# EAGLE design Impedance (EAGLE 9.6.2)
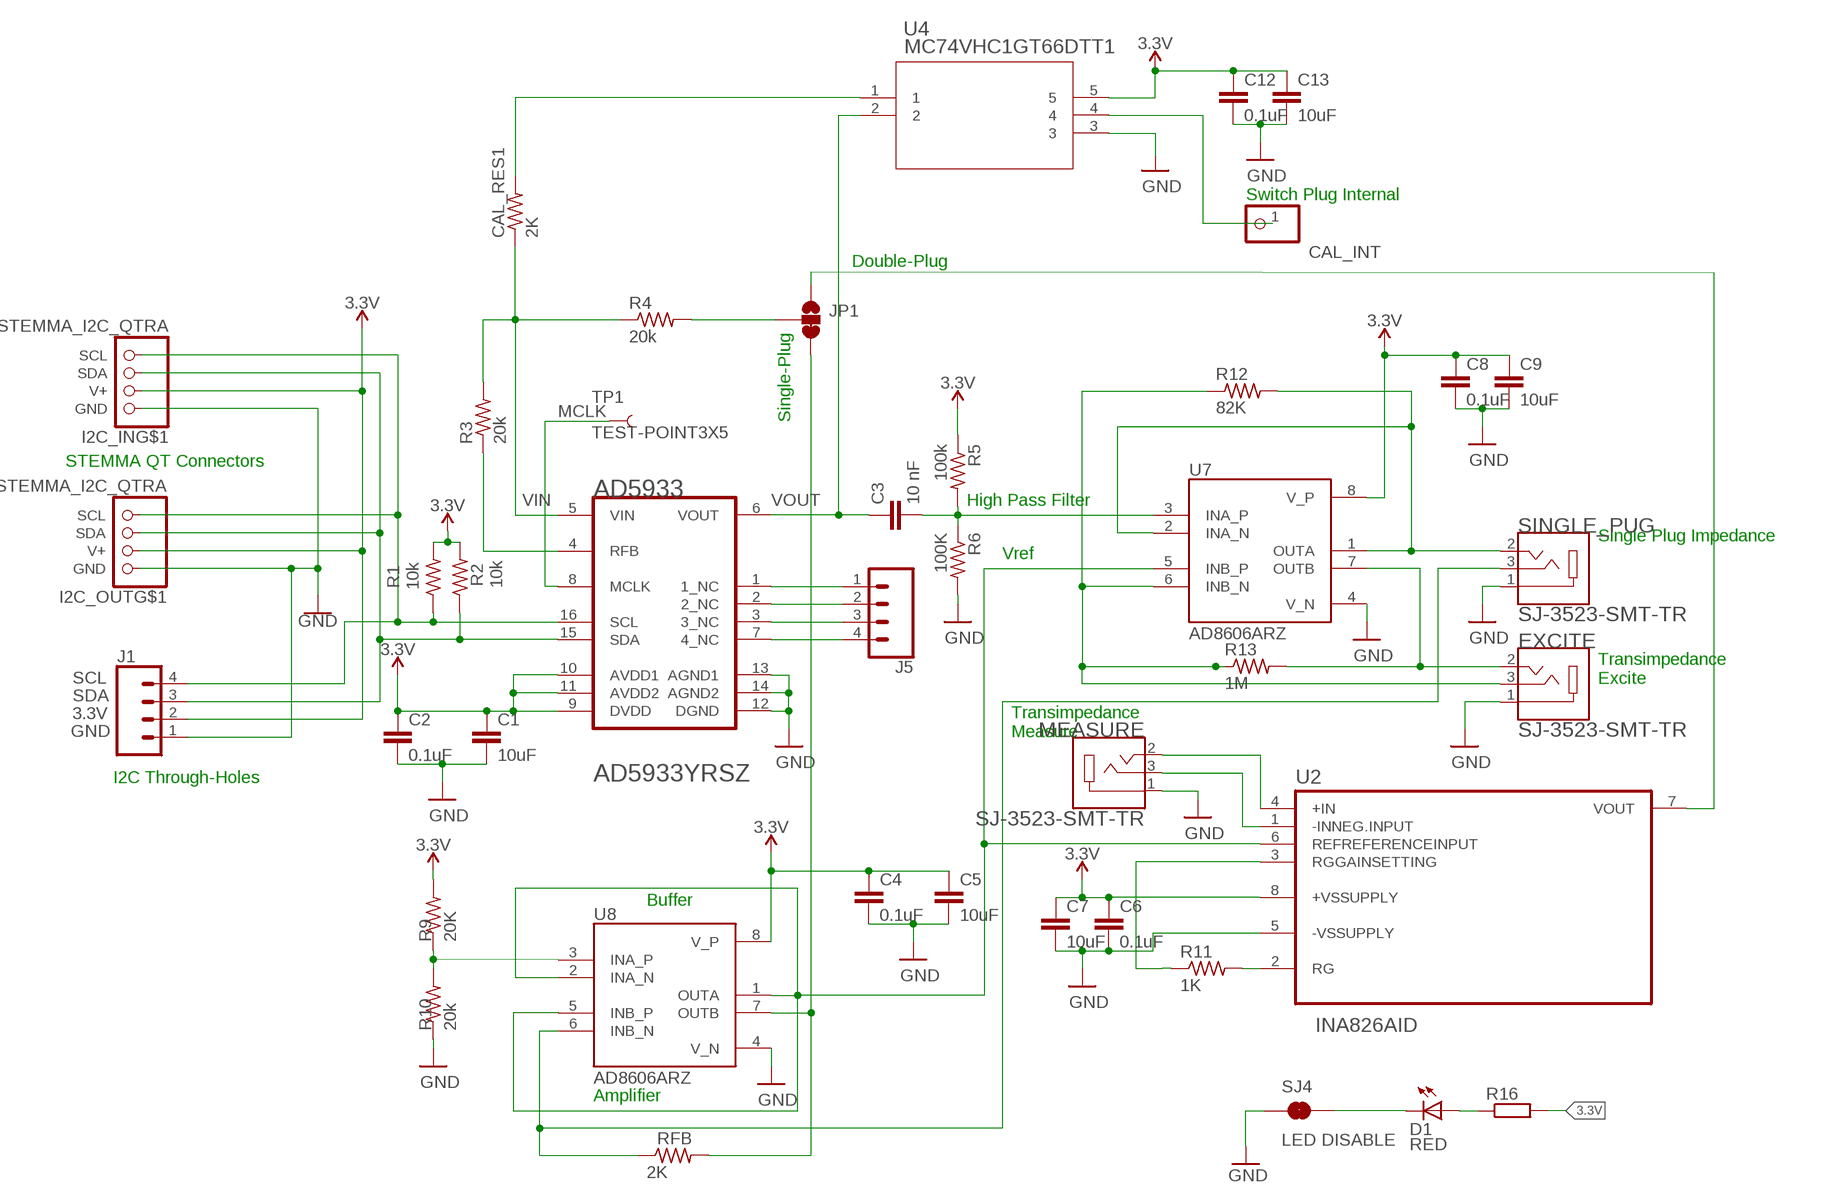
[diagram p0: schematic, sheet 1]

## Parts
AD5933  ANALOG_DEVICES_AD5933YRSZANALOG_DEVICES_AD5933YRSZ_0_0  [ANALOG_DEVICES_AD5933YRSZ_0]
C1  10uF  C-EUC0603  [C0603]
C2  0.1uF  C-EUC0603  [C0603]
C3  10 nF  C-EUC0603  [C0603]
C4  0.1uF  C-EUC0603  [C0603]
C5  10uF  C-EUC0603  [C0603]
C6  0.1uF  C-EUC0603  [C0603]
C7  10uF  C-EUC0603  [C0603]
C8  0.1uF  C-EUC0603  [C0603]
C9  10uF  C-EUC0603  [C0603]
C12  0.1uF  C-EUC0603  [C0603]
C13  10uF  C-EUC0603  [C0603]
CAL_INT  PINHD-1X1  [1X01]
CAL_RES1  2K  R-US_R0603  [R0603]
D1  RED  LED-RED0603  [LED-0603]
EXCITE  SJ-3523-SMT-TR  [CUI_SJ-3523-SMT-TR]
I2C_IN  STEMMA_I2C_QTRA  [JST_SH4_RA]
I2C_OUT  STEMMA_I2C_QTRA  [JST_SH4_RA]
J1  CONN_04  [1X04]
J5  CONN_04  [1X04]
JP1  JUMPER-SMT_3_1-NC_TRACE_NO-SILK  [SMT-JUMPER_3_1-NC_TRACE_NO-SILK]
MEASURE  SJ-3523-SMT-TR  [CUI_SJ-3523-SMT-TR]
R1  10k  R-US_R0603  [R0603]
R2  10k  R-US_R0603  [R0603]
R3  20k  R-US_R0603  [R0603]
R4  20k  R-US_R0603  [R0603]
R5  100k  R-US_R0603  [R0603]
R6  100K  R-US_R0603  [R0603]
R9  20K  R-US_R0603  [R0603]
R10  20k  R-US_R0603  [R0603]
R11  1K  R-US_R0603  [R0603]
R12  82K  R-US_R0603  [R0603]
R13  1M  R-US_R0603  [R0603]
R16  R__0603  R_1K_0603  [R0603]
RFB  2K  R-US_R0603  [R0603]
SINGLE_PUG  SJ-3523-SMT-TR  [CUI_SJ-3523-SMT-TR]
SJ4  LED DISABLE  JUMPER-SMT_2_NC_TRACE_NO-SILK  [SMT-JUMPER_2_NC_TRACE_NO-SILK]
TP1  TEST-POINT3X5  [PAD.03X.05]
U2  INA826AID  [SOIC127P599X175-8N]
U4  MC74VHC1GT66DTT1  [TSOP5_1P65X3P15_ONS]
U7  AD8606ARZ  [SOIC127P600X175-8N]
U8  AD8606ARZ  [SOIC127P600X175-8N]

## Nets
3.3V: AD5933.9(DVDD) AD5933.10(AVDD1) AD5933.11(AVDD2) C1.1 C2.1 C4.1 C5.1 C6.1 C7.1 C8.1 C9.1 C12.1 C13.1 I2C_IN.2(V+) I2C_OUT.2(V+) J1.2 R1.2 R2.2 R5.1 R9.2 R16.2 U2.8(+VSSUPPLY) U4.5 U7.8(V_P) U8.8(V_P)
GND: AD5933.12(DGND) AD5933.13(AGND1) AD5933.14(AGND2) C1.2 C2.2 C4.2 C5.2 C6.2 C7.2 C8.2 C9.2 C12.2 C13.2 EXCITE.1 I2C_IN.1(GND) I2C_OUT.1(GND) J1.1 MEASURE.1 R6.2 R10.1 SINGLE_PUG.1 SJ4.1 U2.5(-VSSUPPLY) U4.3 U7.4(V_N) U8.4(V_N)
MCLK: AD5933.8(MCLK) TP1.P$1
N$1: JP1.2 R4.2
N$2: CAL_INT.1 U4.4
N$3: AD5933.1(1_NC) J5.1
N$4: AD5933.2(2_NC) J5.2
N$5: AD5933.4(RFB) R3.1
N$7: RFB.2 U8.7(OUTB)
N$8: JP1.3
N$9: C3.2 R5.2 R6.1 U7.3(INA_P)
N$10: AD5933.3(3_NC) J5.3
N$11: AD5933.7(4_NC) J5.4
N$13: U2.6(REFREFERENCEINPUT) U7.5(INB_P) U8.1(OUTA) U8.2(INA_N) U8.5(INB_P)
N$14: R9.1 R10.2 U8.3(INA_P)
N$15: R12.2 SINGLE_PUG.2 U7.1(OUTA) U7.2(INA_N)
N$16: R11.1 U2.3(RGGAINSETTING)
N$17: RFB.1 SINGLE_PUG.3 U8.6(INB_N)
N$18: R11.2 U2.2(RG)
N$19: EXCITE.2 R13.2 U7.7(OUTB)
N$20: MEASURE.2 U2.4(+IN)
N$21: MEASURE.3 U2.1(-INNEG.INPUT)
N$23: EXCITE.3 R12.1 R13.1 U7.6(INB_N)
N$24: CAL_RES1.2 U4.1
N$25: JP1.1 U2.7(VOUT)
N$26: D1.A R16.1
N$28: D1.C SJ4.2
SCL: AD5933.16(SCL) I2C_IN.4(SCL) I2C_OUT.4(SCL) J1.4 R1.1
SDA: AD5933.15(SDA) I2C_IN.3(SDA) I2C_OUT.3(SDA) J1.3 R2.1
VIN: AD5933.5(VIN) CAL_RES1.1 R3.2 R4.1
VOUT: AD5933.6(VOUT) C3.1 U4.2
Unconnected: I2C_IN.MT1(MT) I2C_IN.MT2(MT) I2C_OUT.MT1(MT) I2C_OUT.MT2(MT)

## Notes on the sheet
- Switch Plug Internal
- Double-Plug
- Single-Plug
- STEMMA QT Connectors
- High Pass Filter
- Single Plug Impedance
- Vref
- Transimpedance
  Excite
- Transimpedance
  Measure
- I2C Through-Holes
- Buffer
- Amplifier

## Library data of the parts
AD5933 = Analog Devices - AD5933YRSZ:ANALOG_DEVICES_AD5933YRSZ: ADI-AD5933-RS-16; CIIVA_IDS: 19299999; CODE__JEDEC: MO-150-AC; COMPONENT_LINK_1_DESCRIPTION: Manufacturer URL; COMPONENT_LINK_1_URL: www.analog.com; COMPONENT_LINK_3_DESCRIPTION: Package Specification; COMPONENT_LINK_3_URL: http://www.analog.com/static/imported-files/packages/31572257652246RS_16.pdf; DATASHEET: http://www.analog.com/static/imported-files/data_sheets/AD5933.pdf; DATASHEET_VERSION: Rev. D; FOOTPRINT_VARIANT_NAME_0: Level C; FOOTPRINT_VARIANT_NAME_1: Level B; FOOTPRINT_VARIANT_NAME_2: Level A; IMPORTED: yes; IMPORTED_FROM: vault; IMPORT_TS: 1521848033; IO_INTERFACE: Serial; I_SUPPLY_TOTAL_MAX: 15mA; MASTER_FCLK: 16.776MHz; MF: Analog Devices; MPN: AD5933YRSZ; PACKAGE: RS-16; PACKAGE_DESCRIPTION: 16-Lead Shrink Small Outline Package [SSOP]; PACKAGE_VERSION: 3/17/2005; PIN_0_0_15_INSIDE_EDGE: clock; PIN_0_0_7_INSIDE_EDGE: clock; PREFIX: U; RELEASE_DATE: 1333437714; RESOLUTION_BITS: 12bit; TUNING_WORD_WIDTH_BITS: 27bit; VAULT_GUID: 12E548FF-7E75-4596-9B3A-06B167E4919E; VAULT_REVISION: 0B288880-7FBC-46A2-8187-17CED40A7223
C1-C9 C12 C13 = rcl:C-EU: CAPACITOR, European symbol; SPICEPREFIX: C
CAL_INT = pinhead:PINHD-1X1: PIN HEADER
CAL_RES1 R1-R6 R9-R13 RFB = rcl:R-US_: RESISTOR, American symbol; SPICEPREFIX: R
D1 = SparkFun-LED:LED-RED: Assorted Red LEDs LilyPad 1206- DIO-09912 1206- DIO-00809 0603- DIO-00819; PROD_ID: DIO-00819
EXCITE MEASURE SINGLE_PUG = SJ-3523-SMT-TR:SJ-3523-SMT-TR: Audio Jack Connector 3.5 mm Low Profile Surface Mount Stereo Jack, 3 Pin Right-Angle Check availability <https://pricing.snapeda.com/parts/SJ-3523-SMT-TR/CUI%20Devices/view-part?ref=eda>; AVAILABILITY: In Stock; CUI_PURCHASE_URL: https://www.cuidevices.com/product/interconnect/connectors/audio-connectors/jacks/sj-352x-smt-series?utm_source=snapeda.com&utm_medium=referral&utm_campaign=snapedaBOM; DESCRIPTION: 3.5 mm, Stereo, Right Angle, Surface Mount (SMT), 3 Conductors, 0~1 Internal Switches, Audio Jack Connector; MF: CUI Devices; MP: SJ-3523-SMT-TR; PACKAGE: None; PRICE: None; PURCHASE-URL: https://pricing.snapeda.com/search/part/SJ-3523-SMT-TR/?ref=eda
I2C_IN I2C_OUT = adafruit_electromech:STEMMA_I2C; LCSC: C145961
J1 J5 = SparkFun-Connectors:CONN_04: Multi connection point. Often used as Generic Header-pin footprint for 0.1 inch spaced/style header connections On any of the 0.1 inch spaced packages, you can populate with these: Break Away Headers - Straight <https://www.sparkfun.com/products/116> (PRT-00116) Break Away Male Headers - Right Angle <https://www.sparkfun.com/products/553> (PRT-00553) Female Headers <https://www.sparkfun.com/products/115> (PRT-00115) Break Away Headers - Machine Pin <https://www.sparkfun.com/products/117> (PRT-00117) Break Away Female Headers - Swiss Machine Pin <https://www.sparkfun.com/products/743> (PRT-00743) For SCREWTERMINALS and SPRING TERMINALS visit here: Screw Terimnals on SparkFun.com <https://www.sparkfun.com/search/results?term=Screw+Terminals> (5mm/3.5mm/2.54mm spacing) This device is also useful as a general connection point to wire up your design to another part of your project. Our various solder wires solder well into these plated through hole pads. Hook-Up Wire - Assortment (Stranded, 22 AWG) <https://www.sparkfun.com/products/11375> (PRT-11375) Hook-Up Wire - Assortment (Solid Core, 22 AWG) <https://www.sparkfun.com/products/11367> (PRT-11367) View the entire wire category on our website here <https://www.sparkfun.com/categories/141> Special notes: Molex polarized connector foot print use with SKU : PRT-08231 with associated crimp pins and housings. 1MM SMD Version SKU: PRT-10208; PROD_ID: CONN-09696
JP1 = SparkFun-Jumpers:JUMPER-SMT_3_1-NC_TRACE: Normally closed trace jumper (1 of 2 connections) This jumper has a trace between two pads so it's normally closed (NC). The other connection is normally open (NO). Use a razor knife to open the connection. For best results follow the IPC guidelines for cutting traces: Cutout at least 0.063 mm (0.005 in). Remove all loose material to clean up the cut area. Seal the cut with an approved epoxy. Reapply solder to reclose the connection, or to close the NO connection.
R16 = JLC PCB Basic Parts_loc:R_: Resistor General purpose SMD Resistor; LCSC_DATASHEET: https://datasheet.lcsc.com/lcsc/2110252030_UNI-ROYAL-Uniroyal-Elec-0603WAF1001T5E_C21190.pdf; LCSC_PART: C21190; LCSC_ROTATION_CCW: 0; LCSC_STOCK: 5175299; PROPERTIES: ±1% 1/10W Thick Film Resistors 75V ±100ppm -55°C~+155°C 1kOhm 0603 ROHS
SJ4 = SparkFun-Jumpers:JUMPER-SMT_2_NC_TRACE: Normally closed trace jumper This jumper has a trace between two pads so it's normally closed (NC). Use a razor knife to open the connection. For best results follow the IPC guidelines for cutting traces: Cutout at least 0.063 mm (0.005 in). Remove all loose material to clean up the cut area. Seal the cut with an approved epoxy. Reapply solder to reclose the connection.
TP1 = SparkFun-Connectors:TEST-POINT: SparkFun Test Points Bare copper test points for troubleshooting or In-Circuit-Testing. These are used by our Production team for verifying production board runs using pogo-pins on test beds. SparkFun Products: SparkFun LSM9DS1 Breakout <https://www.sparkfun.com/products/13284> SparkFun PSOC <https://www.sparkfun.com/products/13714> SparkFun Load Cell Amplifier <https://www.sparkfun.com/products/13879>
U2 = INA826AID:INA826AID: Check availability <https://pricing.snapeda.com/parts/INA826AID/Texas%20Instruments/view-part?ref=eda>; AVAILABILITY: In Stock; CHECK_PRICES: https://www.snapeda.com/parts/INA826AID/Texas+Instruments/view-part/?ref=eda; DESCRIPTION: Precision, 200-μA Supply Current, 36-V Supply Instrumentation Amplifier; MF: Texas Instruments; MP: INA826AID; PACKAGE: SOIC-8 Texas Instruments; PRICE: None; PURCHASE-URL: https://www.snapeda.com/api/url_track_click_mouser/?unipart_id=217743&manufacturer=Texas Instruments&part_name=INA826AID&search_term=None; SNAPEDA_LINK: https://www.snapeda.com/parts/INA826AID/Texas+Instruments/view-part/?ref=snap
U4 = MC74VHC1GT66DTT1:MC74VHC1GT66DTT1; COPYRIGHT: Copyright (C) 2024 Ultra Librarian. All rights reserved.; MANUFACTURER_PART_NUMBER: MC74VHC1GT66DTT1; MFR_NAME: onsemi
U7 U8 = AD8606ARZ:AD8606ARZ: Operational amplifier; 10MHz; 2.7÷5VDC; Channels: 2; SO8 Check availability <https://pricing.snapeda.com/parts/AD8606ARZ/Analog%20Devices/view-part?ref=eda>; AVAILABILITY: In Stock; CHECK_PRICES: https://www.snapeda.com/parts/AD8606ARZ/Analog+Devices/view-part/?ref=eda; DESCRIPTION: Precision, Low Noise, RRIO, CMOS Op Amp (Dual); MF: Analog Devices; MP: AD8606ARZ; PACKAGE: SOIC-8 Analog Devices; PRICE: None; PURCHASE-URL: https://www.snapeda.com/api/url_track_click_mouser/?unipart_id=43414&manufacturer=Analog Devices&part_name=AD8606ARZ&search_term=None; SNAPEDA_LINK: https://www.snapeda.com/parts/AD8606ARZ/Analog+Devices/view-part/?ref=snap

## Board
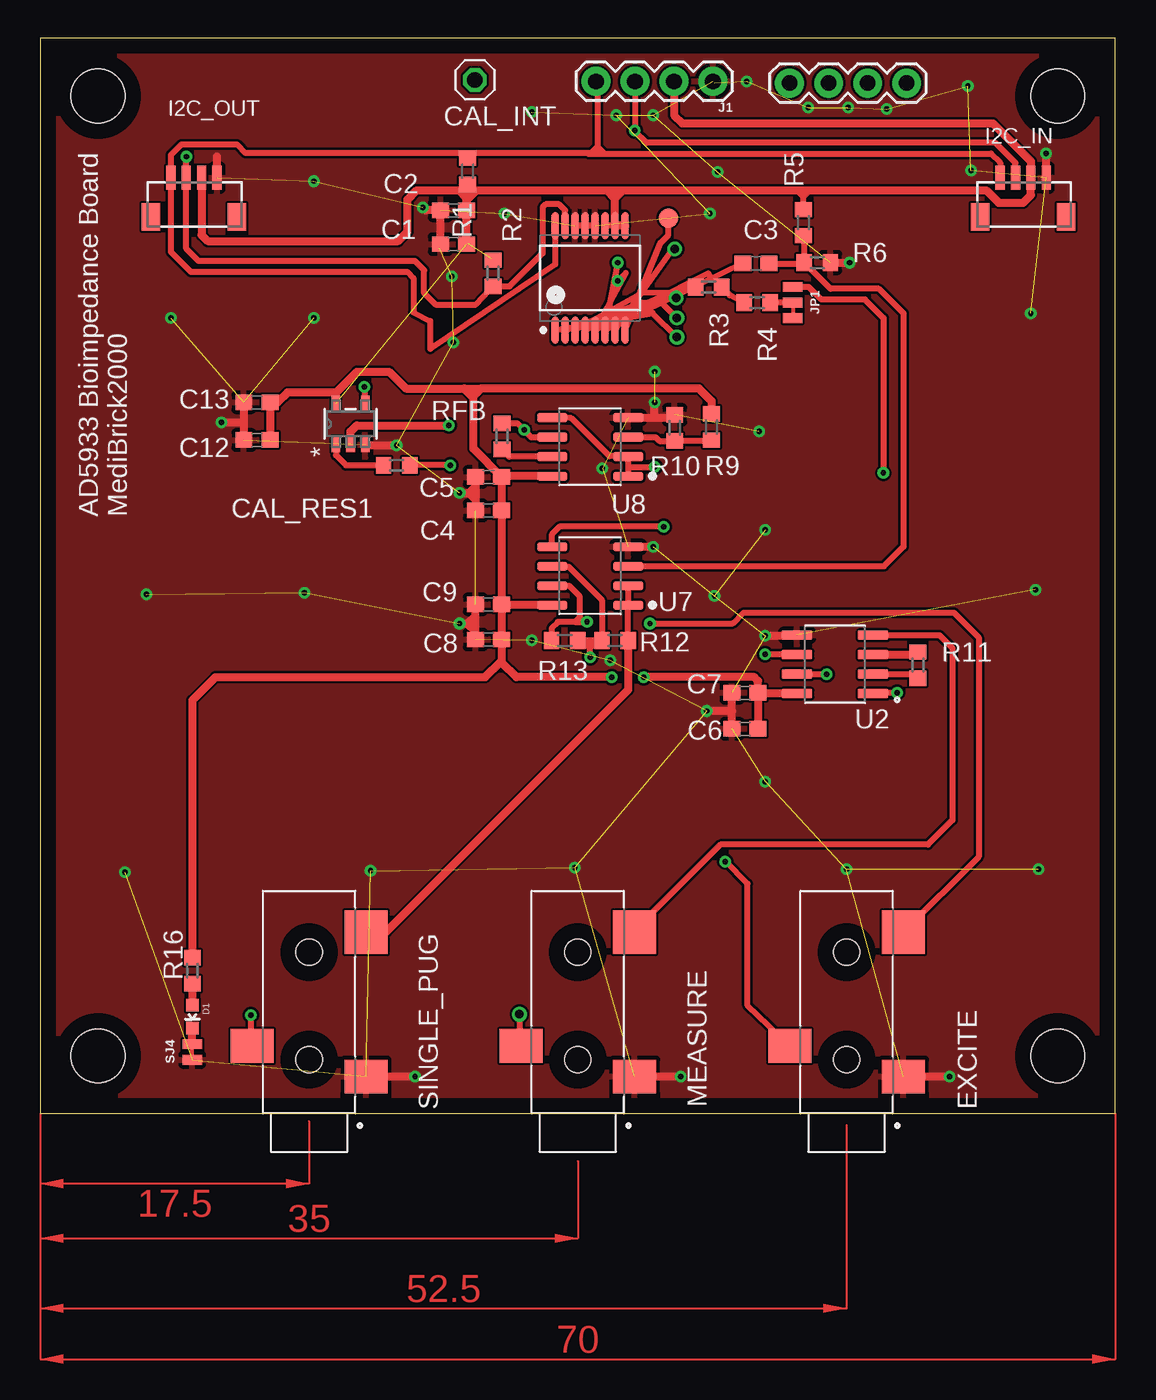
[diagram p1: board, top side]
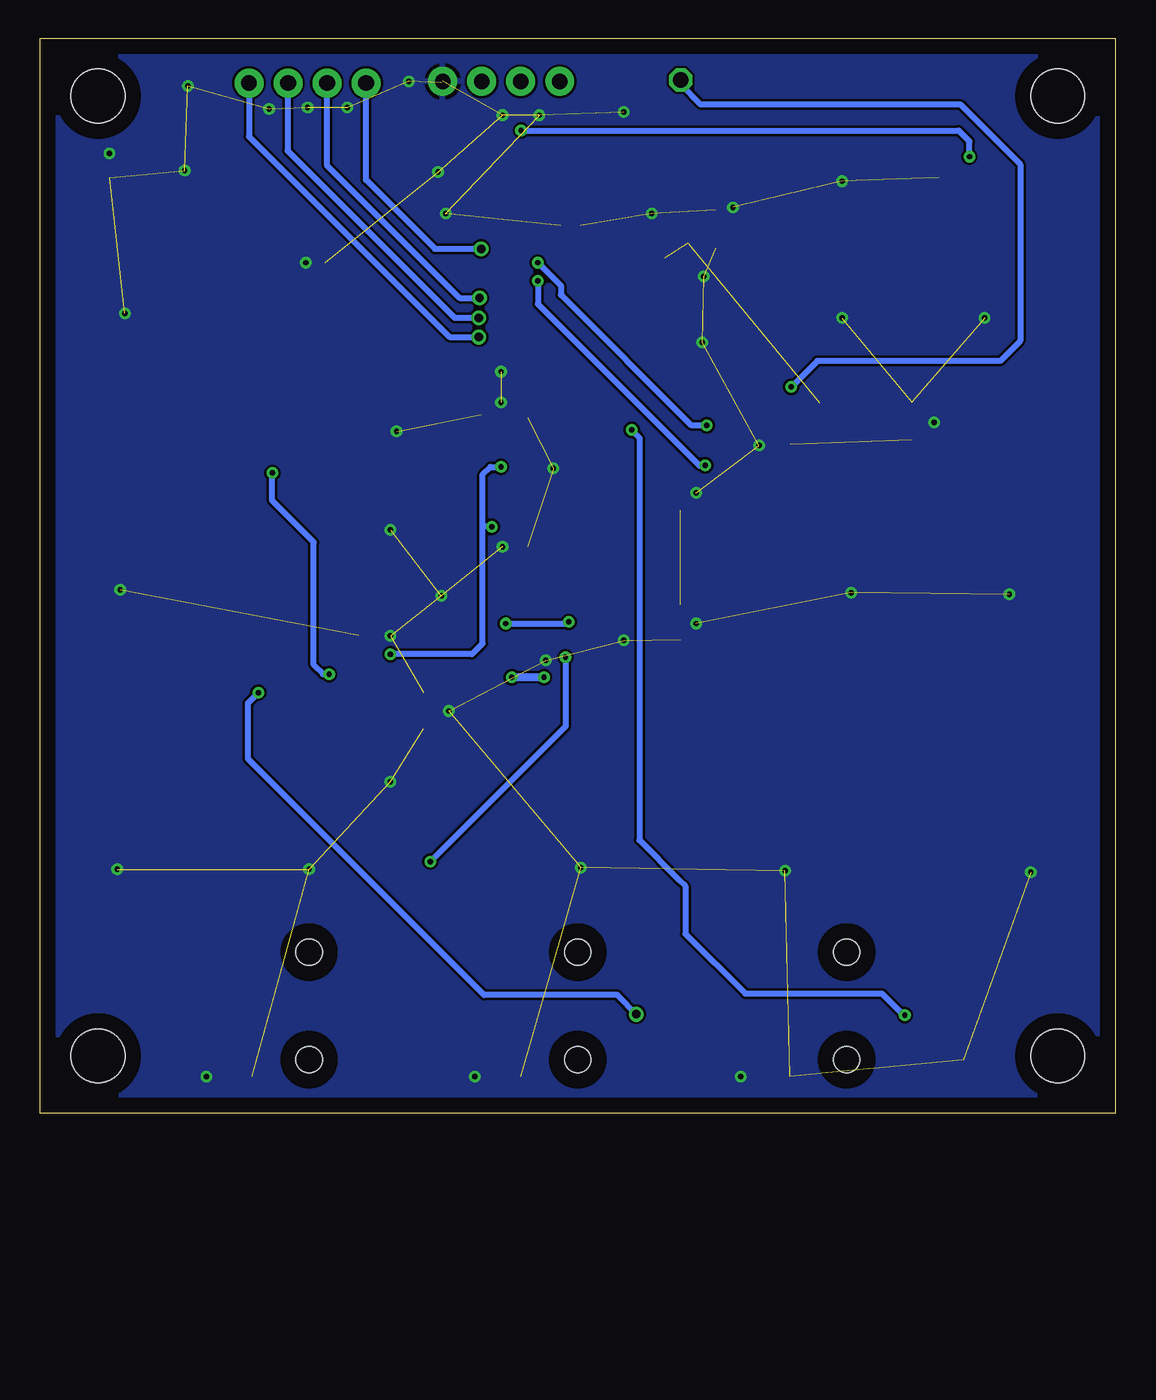
[diagram p2: board, bottom side, seen from below]

Size 70 x 70 mm. Coordinates in mm from the lower left corner, seen from the top.
Outline: 0,0 70,0 70,70 0,70 0,0
Copper layers (1*16): Top 0.035mm / dielectric 1.5mm / Bottom 0.035mm
Design rules "default": minimum track width 6mil, minimum drill 0.35mm, track to track 6mil, track to pad 6mil, pad to pad 6mil, via to via 6mil, smd to smd 6mil, copper to edge 40mil, drill to drill 6mil, minimum pad ring 10mil, minimum via ring 8mil, stop-mask expansion 4mil, vias tented up to drill 0mil, thermal gap 10mil
Holes 3.5 mm at 3.75,66.25 66.25,66.25 3.75,3.75 66.25,3.75

### Footprints (pad centres in the part's own frame; a part is rotated, then mirrored left to right if it is on the bottom)
ANALOG_DEVICES_AD5933YRSZ_0 = smd 1.8 x 0.45: 1 -3.4,2.275; 2 -3.4,1.625; 3 -3.4,0.975; 4 -3.4,0.325; 5 -3.4,-0.325; 6 -3.4,-0.975; 7 -3.4,-1.625; 8 -3.4,-2.275; 9 3.4,-2.275; 10 3.4,-1.625; 11 3.4,-0.975; 12 3.4,-0.325; 13 3.4,0.325; 14 3.4,0.975; 15 3.4,1.625; 16 3.4,2.275
C0603 = smd 1.1 x 1: 1 -0.85,0; 2 0.85,0
1X01 = drill 1.016 octagon: 1 0,0
R0603 = smd 1 x 1.1: 1 -0.85,0; 2 0.85,0
LED-0603 = smd 0.8 x 0.8: A 0,-0.75; C 0,0.75
CUI_SJ-3523-SMT-TR = smd 2.2 x 2.8: 1 -1.1,-3.7; 3 0.9,3.7 | smd 2.8 x 2.8: 2 8.3,-3.7 | hole 1.7: 0,0; 7,0
JST_SH4_RA = smd 0.6 x 1.55: 1 1.5,0.924; 2 0.5,0.924; 3 -0.5,0.924; 4 -1.5,0.924 | smd 1.2 x 1.8: MT1 -2.8,-1.624; MT2 2.8,-1.624
1X04 = drill 1.016 pad 1.88: 1 0,0; 2 2.54,0; 3 5.08,0; 4 7.62,0
SMT-JUMPER_3_1-NC_TRACE_NO-SILK = smd 0.635 x 1.27: 1 -1.016,0; 2 0,0; 3 1.016,0
SMT-JUMPER_2_NC_TRACE_NO-SILK = smd 0.635 x 1.27: 1 -0.508,0; 2 0.508,0
PAD.03X.05 = smd 1.27 x 1.27: P$1 0,0
SOIC127P599X175-8N = smd 1.97 x 0.6: 1 -2.47,1.905; 2 -2.47,0.635; 3 -2.47,-0.635; 4 -2.47,-1.905; 5 2.47,-1.905; 6 2.47,-0.635; 7 2.47,0.635; 8 2.47,1.905
TSOP5_1P65X3P15_ONS = smd 1.029 x 0.559: 1 -1.34,0.95; 2 -1.34,0; 3 -1.34,-0.95; 4 1.34,-0.95; 5 1.34,0.95
SOIC127P600X175-8N = smd 1.97 x 0.6: 1 -2.475,1.905; 2 -2.475,0.635; 3 -2.475,-0.635; 4 -2.475,-1.905; 5 2.475,-1.905; 6 2.475,-0.635; 7 2.475,0.635; 8 2.475,1.905

### Placement (x,y rotation side)
AD5933  35.8,54.4 90 top
C1  26.9,56.6 180 top
C2  26.9,58.8 180 top
C3  46.6,55.34 0 top
C4  29.18,39.26 180 top
C5  29.18,41.45 180 top
C6  45.89,25.05 180 top
C7  45.89,27.39 180 top
C8  29.18,30.86 180 top
C9  29.18,33.15 180 top
C12  14.1,43.85 180 top
C13  14.1,46.3 180 top
CAL_INT  28.3,67.3 0 top
CAL_RES1  23.2,42.2 180 top
D1  9.9,6.3 180 top
EXCITE  52.5,3.5 90 top
I2C_IN  64,60 0 top
I2C_OUT  10,60 0 top
J1  43.8,67.2 180 top
J5  56.41,67.09 180 top
JP1  49,52.8 270 top
MEASURE  35,3.5 90 top
R1  27.81,61.35 270 top
R2  29.49,54.71 90 top
R3  43.52,53.8 0 top
R4  46.68,52.8 0 top
R5  49.7,58 270 top
R6  50.6,55.4 0 top
R9  43.71,44.69 90 top
R10  41.31,44.64 270 top
R11  57.14,29.19 270 top
R12  37.42,30.8 0 top
R13  34.14,30.8 180 top
R16  9.9,9.3 90 top
RFB  30.06,44.09 270 top
SINGLE_PUG  17.5,3.5 90 top
SJ4  9.9,4 90 top
TP1  40.9,58.3 0 top
U2  51.75,29.24 180 top
U4  20.2,44.9 90 top
U7  35.8,35 180 top
U8  35.8,43.4 180 top

### Tracks (layer width: path | path; a pad name or v marks a point on that pad's centre or on a via)
3.3V  (via drill 0.35)  (2 unrouted)
  Top 0.406: AD5933.10 AD5933.11 | R1.2 27.8,60.1 | 29.35,55.7 R2.2 | R5.1 49.7,59.7 | 49.7,60.1 49.7,59.7 | 49.7,59.7 50.1,60.1 50.2,60.1 | 49.7,59.7 49.4,60 49.4,60.1
  Top 0.508: C5.1 C4.1 C9.1 | C5.1 30.04,41.44 | C7.1 C6.1 | C7.1 46.84,27.29 46.84,27.39 46.9,27.34 U2.8 | C1.1 27.79,56.66 | C1.1 C2.1 | J1.2 41.26,65 41.8,64.46 62.04,64.46 64.5,62 I2C_IN.2 64.5,59.8 64,59.3 62.4,59.3 61.6,60.1 50.2,60.1 49.7,60.1 49.4,60.1 37.92,60.1 | AD5933.9 AD5933.10 37.42,59.6 | 28.4,60.1 27.75,59.45 C2.1 | 27.25,60.1 27.75,59.6 C2.1 | I2C_OUT.2 10.5,57.2 10.9,56.8 23.3,56.8 23.9,57.4 23.9,59.5 24.5,60.1 27.25,60.1 | 28.4,60.1 36.9,60.1 | 36.9,60.1 37.4,60.1 | 37.4,60.1 37.92,60.1 | R9.2 43.71,46.39 42.9,47.2 28.7,47.2 | C5.1 28.2,43.28 28.2,46.6 28.15,46.65 | 28.7,47.2 28.15,46.65 | U8.8 30.07,41.49 C5.1 | C9.1 C8.1 30.03,29.37 | C9.1 30.08,33.2 | C12.1 C13.1 15.46,46.3 16.1,46.94 19.25,46.94 | U4.5 19.25,46.94 | 30.03,29.37 29.98,29.42 28.97,28.4 11.4,28.4 9.9,26.9 R16.2 | 30.03,29.37 31,28.4 v37.2,28.4 37.3,28.4 | v39.3,28.4 46.5,28.4 46.74,28.16 C7.1 | U7.8 30.09,33.09 C9.1 | 28.15,46.65 27.6,47.2 | 27.6,47.2 23.8,47.2 22.7,48.3 20.61,48.3 19.25,46.94 | 27.25,60.1 27.8,60.1 28.4,60.1 | 27.6,47.2 28.7,47.2 | C1.1 27.82,56.67 | C1.1 27.75,58.2 | 37.42,59.6 37.42,60.08 37.4,60.1 | 37.42,59.6 37.92,60.1 | 37.42,59.6 37.4,59.6 36.9,60.1
  Bottom 0.508: v39.3,28.4 v37.2,28.4
GND  (via drill 0.35)  (51 unrouted)
  Top 0.406: 41.08,45.26 R10.1 | AD5933.12 AD5933.13 AD5933.14
  Top 0.508: v24.9,59 25.1,58.8 C2.2 C1.2 26.05,56.4 26,56.35 | I2C_IN.1 v65.5,62.5 | I2C_OUT.1 11.5,62.3 | R6.2 v52.7,55.4 52.8,55.4 | C5.2 28.33,40.83 | 28.33,40.83 28.33,40.4 | 28.33,40.4 28.33,39.97 | 28.33,39.97 C4.2 | 28.33,40.4 27.9,40.4 | v27.3,40.4 27.9,40.4 | U8.4 40,45.3 | 40,45.3 41.04,45.3 41.08,45.26 | 40,45.3 v40,46.3 | C8.2 28.33,31.37 | 28.33,31.37 28.33,31.9 | 28.33,31.9 28.33,32.43 | 28.33,32.43 C9.2 | 28.33,31.9 27.8,31.9 | v27.3,31.9 27.8,31.9 | U7.4 v39.9,36.91 v39.9,36.9 | C6.2 45.04,26.2 | 45.04,26.2 C7.2 | 45.04,26.2 v43.4,26.2 | U2.5 49.2,31.1 v47.2,31.1 | SINGLE_PUG.1 v24.4,2.4 | MEASURE.1 v41.7,2.4 | EXCITE.1 v59.2,2.4 59.3,2.4 | C13.2 13.25,45.1 | 13.25,45.1 C12.2 | 13.25,45.1 13.15,45 v11.8,45 | v23.2,43.5 21.21,43.5 U4.3 | 27.9,40.4 28.33,40.83 | 27.9,40.4 28.33,39.97 | 27.8,31.9 28.33,32.43 | 27.8,31.9 28.33,31.37
  Bottom 0.508: 43.9,67.1 J1.1 | v41.7,2.4 41.8,2.3
  other vias: 46,67.2 26.8,54.5 32,30.8 37.1,29.5 43.6,58.6 40,48.3 46.8,44.4 36.6,42 37.5,65 39.9,65 26.9,50.2 47.2,21.6 32,65.2 17.8,51.8 17.2,33.9 21.5,15.8 34.8,16 52.5,15.9 65,15.9 64.8,34.1 43.9,33.7 64.5,52.1 6.9,33.8 8.5,51.8 47.2,38 5.5,15.7 60.4,66.9 17.8,60.7 44.1,61.3 60.6,61.4 30.2,58.6 50,65.5 52.6,65.5 55.1,65.4
  pour Top: 0,70 0,0 70,0 70,70
  pour Bottom: 0,70 0,0 70,0 70,70
MCLK
  Top 0.406: AD5933.8 40.38,56.67 40.9,57.2 TP1.P$1
N$1
  Top 0.406: JP1.2 R4.2
N$2  (via drill 0.35)
  Top 0.406: U4.4 21.15,46.55 21.1,46.6 v21.1,47.3
  Bottom 0.406: CAL_INT.1 28.3,67 27,65.7 10.1,65.7 6.2,61.8 6.2,50.3 7.5,49 19.4,49 v21.1,47.3
N$3  (via drill 0.55)
  Top 0.406: v41.45,50.55 39.88,52.12 AD5933.1
  Bottom 0.406: J5.1 56.41,63.61 43.35,50.55 v41.45,50.55
N$4  (via drill 0.55)
  Top 0.406: AD5933.2 39.2,52.78 40.48,52.77 v41.45,51.8
  Bottom 0.406: v41.45,51.8 43,51.8 53.9,62.7 53.9,67.06 J5.2
N$5
  Top 0.406: AD5933.4 42.44,54.06 42.67,53.83 R3.1
N$7
  Top 0.406: RFB.2 30.54,42.77 U8.7
N$9
  Top 0.406: R6.1 49.68,55.34 C3.2 47.45,55.25 | R6.1 49.75,57.06 R5.2 | U7.3 54.94,35.63 56.2,36.9 56.2,52.1 54.6,53.7 51.45,53.7 R6.1
N$10  (via drill 0.55)
  Top 0.406: AD5933.3 39.2,53.43 41.08,53.42 v41.4,53.1
  Bottom 0.406: v41.4,53.1 42.7,53.1 51.35,61.75 51.35,67.07 J5.3
N$11  (via drill 0.55)
  Top 0.406: AD5933.7 41.01,56.01 v41.3,56.3
  Bottom 0.406: v41.3,56.3 44.3,56.3 48.79,60.79 J5.4
N$13  (via drill 0.35)
  Top 0.406: U8.5 33.92,45.3 34.58,45.27 37.05,42.8 38.24,42.8 U8.2 38.27,42.1 | 38.27,42.1 U8.1 | 38.27,42.1 v40,42.1 | U7.5 33.33,37.73 33.8,38.2 v40.6,38.2 | v47.2,29.9 49.26,29.9 U2.6
  Bottom 0.406: v40,42.1 40.7,42.1 41.2,41.6 41.2,38.2 | 40.7,38.2 v40.6,38.2 41.2,38.2 | 47.3,29.9 v47.2,29.9 41.9,29.9 41.2,30.6 41.2,38.2
N$14
  Top 0.406: R9.1 43.66,43.79 R10.2 40.31,43.79 40.06,44.03 U8.3
N$15
  Top 0.406: U7.2 U7.1 R12.2
  Top 0.508: R12.2 38.27,27.57 22.5,11.8 SINGLE_PUG.2
N$16
  Top 0.406: 57.1,30.07 R11.1 56.94,29.84
  Top 0.508: U2.3 56.91,29.88 56.94,29.84
N$17  (via drill 0.35)
  Top 0.406: U8.6 31.96,44.03 v31.5,44.5 31.06,44.94 RFB.1 | SINGLE_PUG.3 13.7,4.5 v13.7,6.4
  Bottom 0.406: 13.8,6.4 15.2,7.8 24.1,7.8 28,11.7 28,14.8 28.4,15.2 31,17.8 31,44 v31.5,44.5 | 13.8,6.4 13.7,6.3 | 13.8,6.4 v13.7,6.4
N$18
  Top 0.406: R11.2 56.88,28.61 U2.2
N$19  (via drill 0.35)
  Top 0.406: U7.7 34.44,34.37 35.1,33.7 35.1,32.3 | 35.1,32.3 34.8,32 | 34.8,32 33.7,32 33.29,31.59 R13.2 | 35.1,32.3 35.4,32 v35.6,32 34.8,32 | v39.7,31.9 45.1,31.9 45.8,32.6 59.5,32.6 61.1,31 61.1,16.7 EXCITE.2
  Bottom 0.406: v39.7,31.9 35.7,31.9 v35.6,32
N$20
  Top 0.406: 39.55,12.83 MEASURE.2 38.7,11.9 44.3,17.5 57.8,17.5 59.4,19.1 59.4,30.3 58.55,31.14 U2.4
N$21  (via drill 0.35, 0.55)
  Top 0.406: v31.2,6.45 31.2,5.12 MEASURE.3 | U2.1 54.28,27.4 v55.8,27.4 55.9,27.4
  Bottom 0.406: v31.2,6.45 32.4,7.65 32.4,7.7 41.1,7.7 56.5,23.1 56.5,26.7 v55.8,27.4
N$23  (via drill 0.35)
  Top 0.406: EXCITE.3 46.05,7.03 46.05,14.95 v44.6,16.4 | U7.6 33.36,35.6 34.4,35.6 36.57,33.43 R12.1 | R12.1 36.57,30.83 36.1,30.82 | R13.1 35.4,30.81 | 35.4,30.81 35.7,30.81 35.8,30.82 | 35.8,30.82 36.1,30.82 | 36.6,30.77 R12.1 | v35.8,29.7 | v35.8,29.7 35.8,30.3 | 35.8,30.82 35.8,30.3 | 35.8,30.3 36.1,30.6 36.1,30.82 | 35.8,30.3 35.4,30.7 35.4,30.81
  Bottom 0.406: v44.6,16.4 35.8,25.2 v35.8,29.7
N$24
  Top 0.406: U4.1 19.25,42.85 19.9,42.2 CAL_RES1.2
N$25  (via drill 0.35)
  Top 0.406: U2.7 v51.2,28.61 v51.2,28.6 | v54.9,41.7 54.9,51.8 53.7,53 50.86,53 50.04,53.82 JP1.1
  Bottom 0.406: v54.9,41.7 54.9,39.9 52.2,37.2 52.2,29.2 51.6,28.6 v51.2,28.6
N$26
  Top 0.508: R16.1 D1.A
N$28
  Top 0.508: SJ4.2 D1.C
SCL
  Top 0.406: J1.4 36.28,67.1 36.28,62.95 | 36.28,62.95 36.73,62.5 | I2C_IN.4 62.5,61.9 61.9,62.5 36.73,62.5 | 36.28,62.95 35.86,62.53 35.6,62.53 | 35.6,62.53 28.14,62.53 | 28.14,62.53 13.37,62.53 12.8,63.1 9.2,63.1 8.5,62.4 I2C_OUT.4 8.5,56.1 9.8,54.8 23.9,54.8 24.3,54.4 24.3,52.15 25.39,51.6 25.39,49.78 33.52,55.27 AD5933.16 | 35.6,62.53 35.63,62.5 36.73,62.5 | 28.14,62.53 R1.1
SDA  (via drill 0.35)
  Top 0.406: v9.5,62.3 I2C_OUT.3 9.5,60.4 | J1.3 38.72,64.02 v38.7,64 39.5,63.2 62.2,63.2 63.5,61.9 I2C_IN.3 63.5,60.8 | 9.5,60.4 9.4,60.5 | 9.5,60.4 9.5,56.3 10.3,55.5 24.4,55.5 25,54.9 25,53.4 25.73,52.67 28.37,52.67 29.2,53.58 R2.1 30.56,53.86 32.7,56 32.7,59 32.9,59.2 33.78,59.2 34.17,58.8 AD5933.15
  Bottom 0.406: v9.5,62.3 9.5,63.3 10.2,64 v38.7,64
VIN  (via drill 0.35)
  Top 0.406: R4.1 44.89,53.28 R3.2 43.51,54.66 43.48,54.71 AD5933.5 38.12,54.73 v37.6,54.2 | v26.7,42.2 CAL_RES1.1
  Bottom 0.406: v26.7,42.2 26.73,42.17 27.07,42.17 37.6,52.7 v37.6,54.2
VOUT  (via drill 0.35)
  Top 0.406: C3.1 45.72,55.37 AD5933.6 37.62,55.38 v37.6,55.4
  Top 0.508: U4.2 20.2,44.4 20.6,44.8 v26.6,44.8
  Bottom 0.406: v37.6,55.4 36.1,53.9 36.1,53.3 27.6,44.8 v26.6,44.8
(copper drawn outside any net)
  shapes: Top area x4

### Text on the board
tNames: AD5933 Bioimpedance Board / MediBrick2000